# Altium schematic sheet MOUTING.SchDoc
size 420 x 297 mm; SheetNumber: 21; SheetTotal: 21
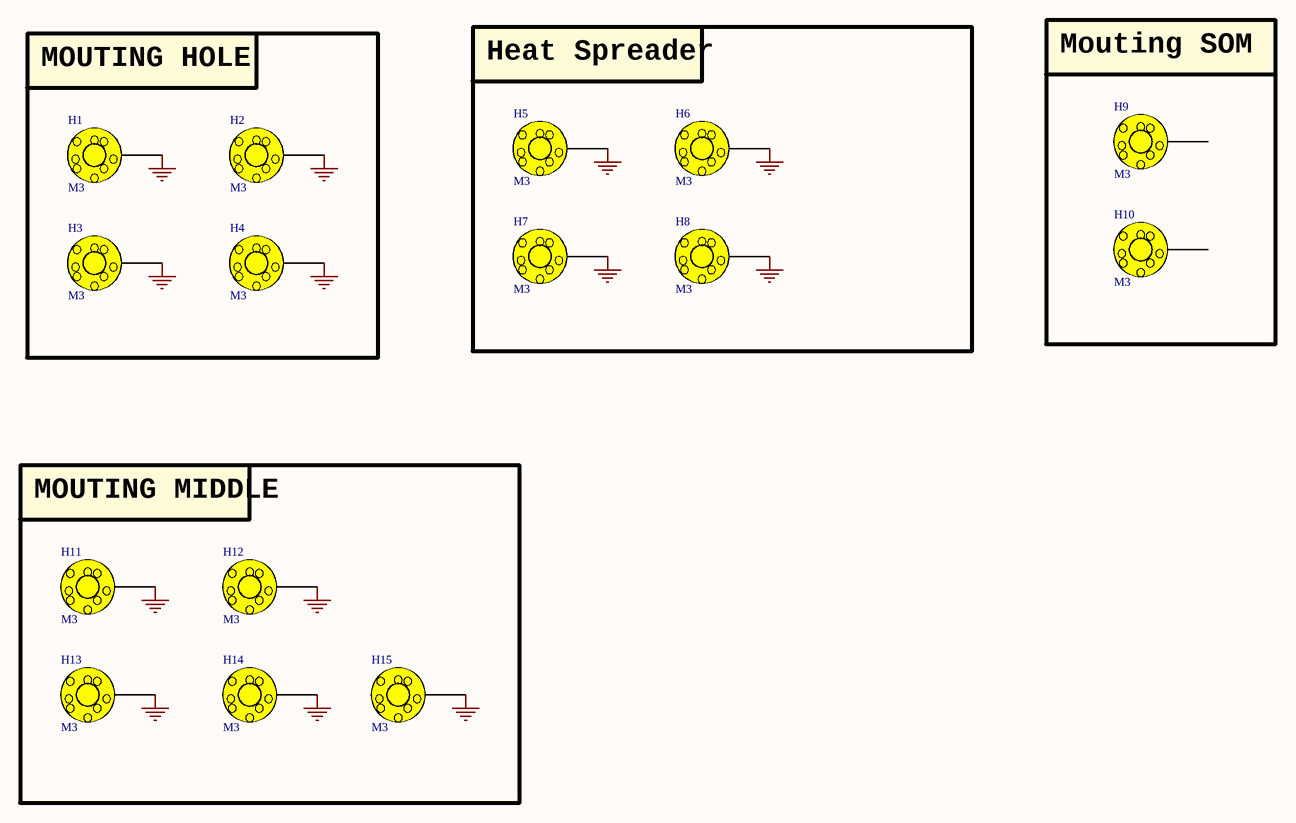
[diagram p0: MOUTING.SchDoc]

## Parts
H1  M3  [HEX-M3_NoVia]
H2  M3  [HEX-M3_NoVia]
H3  M3  [HEX-M3_NoVia]
H4  M3  [HEX-M3_NoVia]
H5  M3  [HEX-M3_NoVia]
H6  M3  [HEX-M3_NoVia]
H7  M3  [HEX-M3_NoVia]
H8  M3  [HEX-M3_NoVia]
H9  M3  [Testpoint_TH_D450H250]
H10  M3  [Testpoint_TH_D450H250]
H11  M3  [HEX-M3_NoVia]
H12  M3  [HEX-M3_NoVia]
H13  M3  [HEX-M3_NoVia]
H14  M3  [HEX-M3_NoVia]
H15  M3  [HEX-M3_NoVia]

## Blocks framed on the sheet
MOUTING HOLE: H1-H4
Heat Spreader: H5-H8
Mouting SOM: H9 H10
MOUTING MIDDLE: H11-H15

## Nets
GND: H1.1 H2.1 H3.1 H4.1 H5.1 H6.1 H7.1 H8.1 H11.1 H12.1 H13.1 H14.1 H15.1

Not connected (* = marked no-connect by the designer): H9 1; H10 1

## Notes on the sheet
- Project:
- Sub-system:
- Design by:
- BAO BUI Q.
- Sheet title:
- Sheet
- A3
- of
- Checked by:
- Approved by:
- VU PHAM
- Revision:
- Document No:
- Size:
- Date:

## Library data of the parts
H1-H15 = HEX-M3